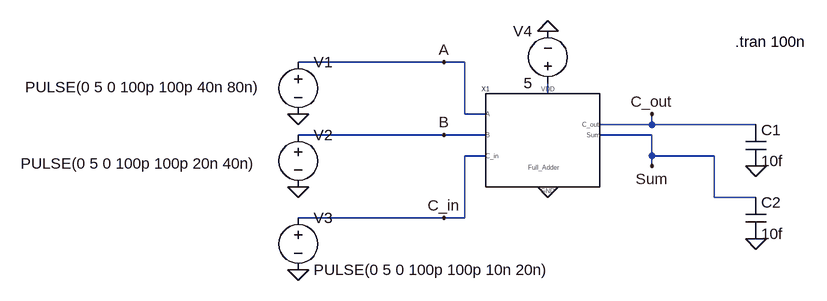
[diagram p0: schematic Full_adder_test.asc]
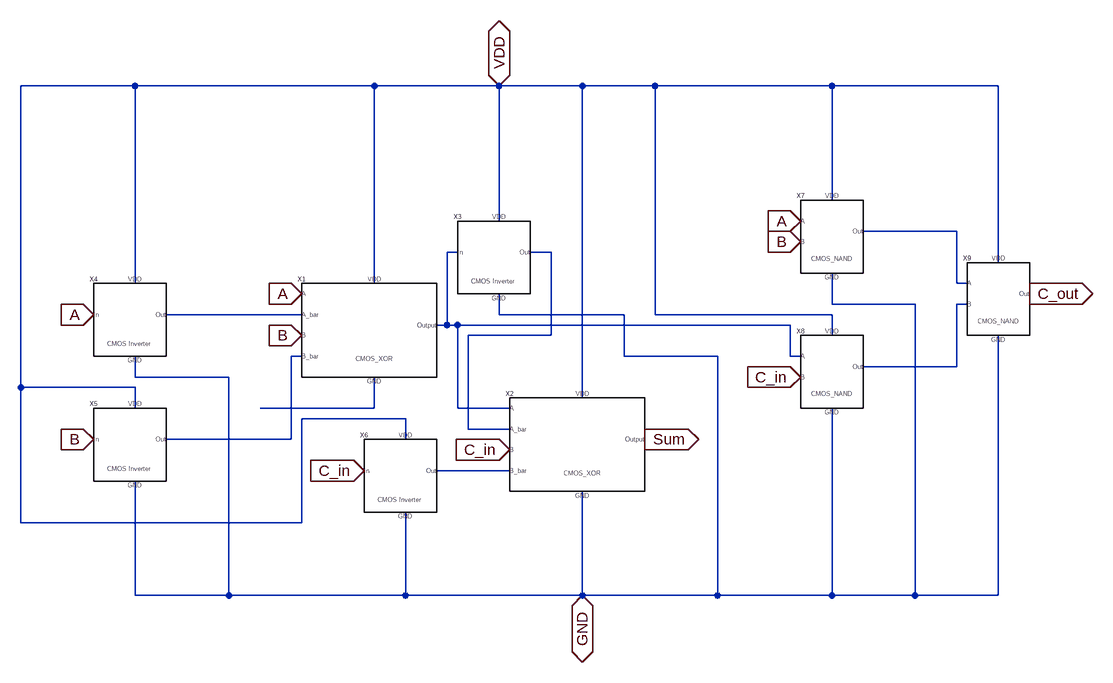
[diagram p1: sub-circuit full_adder.asc]
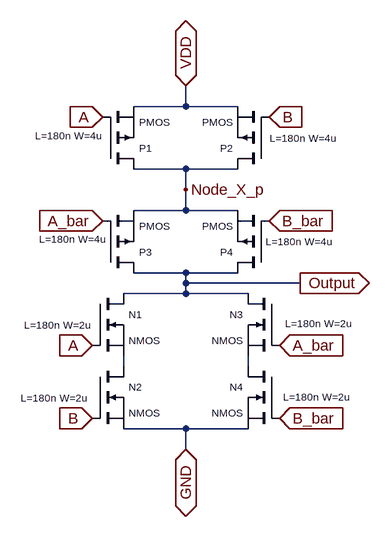
[diagram p2: sub-circuit cmos_xor.asc]
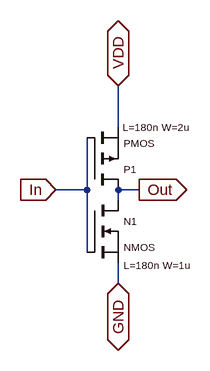
[diagram p3: sub-circuit cmos_inveter.asc]
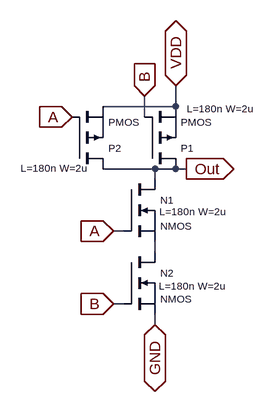
[diagram p4: sub-circuit cmos_nand_2input.asc]
Full_adder_test.asc, the LTspice schematic file:
Version 4.1
SHEET 1 1140 680
WIRE 224 32 0 32
WIRE 256 32 224 32
WIRE 384 80 384 64
WIRE 256 112 256 32
WIRE 288 112 256 112
WIRE 544 128 544 112
WIRE 544 128 464 128
WIRE 704 128 544 128
WIRE 224 144 0 144
WIRE 288 144 224 144
WIRE 544 144 464 144
WIRE 288 176 256 176
WIRE 544 176 544 144
WIRE 640 176 544 176
WIRE 544 192 544 176
WIRE 640 240 640 176
WIRE 704 240 640 240
WIRE 224 272 0 272
WIRE 256 272 256 176
WIRE 256 272 224 272
FLAG 0 112 0
FLAG 0 224 0
FLAG 0 352 0
FLAG 384 -16 0
FLAG 384 224 0
FLAG 544 112 C_out
FLAG 544 192 Sum
FLAG 224 32 A
FLAG 224 144 B
FLAG 224 272 C_in
FLAG 704 192 0
FLAG 704 304 0
SYMBOL Full_adder 368 144 R0
SYMATTR InstName X1
SYMBOL voltage 0 16 R0
WINDOW 3 -420 54 Left 2
WINDOW 123 0 0 Left 0
WINDOW 39 0 0 Left 0
SYMATTR InstName V1
SYMATTR Value PULSE(0 5 0 100p 100p 40n 80n)
SYMBOL voltage 0 128 R0
WINDOW 3 -427 60 Left 2
WINDOW 123 0 0 Left 0
WINDOW 39 0 0 Left 0
SYMATTR InstName V2
SYMATTR Value PULSE(0 5 0 100p 100p 20n 40n)
SYMBOL voltage 0 256 R0
WINDOW 123 0 0 Left 0
WINDOW 39 0 0 Left 0
SYMATTR InstName V3
SYMATTR Value PULSE(0 5 0 100p 100p 10n 20n)
SYMBOL voltage 384 80 R180
WINDOW 0 24 96 Left 2
WINDOW 3 24 16 Left 2
WINDOW 123 0 0 Left 0
WINDOW 39 0 0 Left 0
SYMATTR InstName V4
SYMATTR Value 5
SYMBOL cap 688 128 R0
SYMATTR InstName C1
SYMATTR Value 10f
SYMBOL cap 688 240 R0
SYMATTR InstName C2
SYMATTR Value 10f
TEXT 672 0 Left 2 !.tran 100n

full_adder.asc, the sub-circuit schematic file:
Version 4.1
SHEET 1 1296 680
WIRE -208 -320 -384 -320
WIRE 160 -320 -208 -320
WIRE 352 -320 160 -320
WIRE 480 -320 352 -320
WIRE 592 -320 480 -320
WIRE 864 -320 592 -320
WIRE 1120 -320 864 -320
WIRE 864 -144 864 -320
WIRE 352 -112 352 -320
WIRE 1056 -96 912 -96
WIRE 288 -64 272 -64
WIRE 432 -64 400 -64
WIRE 1120 -48 1120 -320
WIRE -208 -16 -208 -320
WIRE 160 -16 160 -320
WIRE 1056 -16 1056 -96
WIRE 1072 -16 1056 -16
WIRE 864 16 864 -32
WIRE 992 16 864 16
WIRE 1072 16 1056 16
WIRE 48 32 -160 32
WIRE 352 32 352 0
WIRE 544 32 352 32
WIRE 592 32 592 -320
WIRE 864 32 592 32
WIRE 272 48 272 -64
WIRE 272 48 256 48
WIRE 288 48 272 48
WIRE 800 48 288 48
WIRE 432 64 432 -64
WIRE 432 64 304 64
WIRE 864 64 864 32
WIRE 48 96 32 96
WIRE 544 96 544 32
WIRE 688 96 544 96
WIRE 800 96 800 48
WIRE 816 96 800 96
WIRE 1056 112 1056 16
WIRE 1056 112 912 112
WIRE -208 128 -208 96
WIRE -64 128 -208 128
WIRE -384 144 -384 -320
WIRE -208 144 -384 144
WIRE 480 160 480 -320
WIRE -208 176 -208 144
WIRE 160 176 160 128
WIRE 160 176 -16 176
WIRE 288 176 288 48
WIRE 368 176 288 176
WIRE 208 192 48 192
WIRE 304 208 304 64
WIRE 368 208 304 208
WIRE 32 224 32 96
WIRE 32 224 -160 224
WIRE 208 224 208 192
WIRE 368 272 256 272
WIRE -384 352 -384 144
WIRE 48 352 48 192
WIRE 48 352 -384 352
WIRE -208 464 -208 288
WIRE -64 464 -64 128
WIRE -64 464 -208 464
WIRE 208 464 208 336
WIRE 208 464 -64 464
WIRE 480 464 480 304
WIRE 480 464 208 464
WIRE 688 464 688 96
WIRE 688 464 480 464
WIRE 864 464 864 176
WIRE 864 464 688 464
WIRE 992 464 992 16
WIRE 992 464 864 464
WIRE 1120 464 1120 64
WIRE 1120 464 992 464
FLAG 48 0 A
IOPIN 48 0 In
FLAG 48 64 B
IOPIN 48 64 In
FLAG 368 240 C_in
IOPIN 368 240 In
FLAG -272 32 A
IOPIN -272 32 In
FLAG -272 224 B
IOPIN -272 224 In
FLAG 144 272 C_in
IOPIN 144 272 In
FLAG 576 224 Sum
IOPIN 576 224 Out
FLAG 816 -112 A
IOPIN 816 -112 In
FLAG 816 -80 B
IOPIN 816 -80 In
FLAG 816 128 C_in
IOPIN 816 128 In
FLAG 1168 0 C_out
IOPIN 1168 0 Out
FLAG 352 -320 VDD
IOPIN 352 -320 BiDir
FLAG 480 464 GND
IOPIN 480 464 BiDir
SYMBOL CMOS_XOR 144 48 R0
SYMATTR InstName X1
SYMBOL CMOS_XOR 464 224 R0
SYMATTR InstName X2
SYMBOL CMOS_Inveter -224 32 R0
SYMATTR InstName X4
SYMBOL CMOS_Inveter -224 224 R0
SYMATTR InstName X5
SYMBOL CMOS_Inveter 336 -64 R0
SYMATTR InstName X3
SYMBOL CMOS_Inveter 192 272 R0
SYMATTR InstName X6
SYMBOL CMOS_NAND_2input 864 -96 R0
SYMATTR InstName X7
SYMBOL CMOS_NAND_2input 864 112 R0
SYMATTR InstName X8
SYMBOL CMOS_NAND_2input 1120 0 R0
SYMATTR InstName X9

cmos_xor.asc, the sub-circuit schematic file:
Version 4.1
SHEET 1 880 680
WIRE 208 -192 208 -224
WIRE 208 -192 128 -192
WIRE 288 -192 208 -192
WIRE 208 -96 128 -96
WIRE 288 -96 208 -96
WIRE 208 -64 208 -96
WIRE 208 -32 208 -64
WIRE 208 -32 128 -32
WIRE 288 -32 208 -32
WIRE 208 64 128 64
WIRE 288 64 208 64
WIRE 208 80 208 64
WIRE 384 80 208 80
WIRE 208 96 208 80
WIRE 208 96 112 96
WIRE 304 96 208 96
WIRE 112 208 112 192
WIRE 304 208 304 192
WIRE 208 304 112 304
WIRE 304 304 208 304
WIRE 208 336 208 304
FLAG 64 176 A
IOPIN 64 176 In
FLAG 64 288 B
IOPIN 64 288 In
FLAG 352 176 A_bar
IOPIN 352 176 In
FLAG 352 288 B_bar
IOPIN 352 288 In
FLAG 208 336 GND
IOPIN 208 336 BiDir
FLAG 208 -224 VDD
IOPIN 208 -224 BiDir
FLAG 384 80 Output
IOPIN 384 80 Out
FLAG 80 -176 A
IOPIN 80 -176 In
FLAG 80 -16 A_bar
IOPIN 80 -16 In
FLAG 336 -176 B
IOPIN 336 -176 In
FLAG 336 -16 B_bar
IOPIN 336 -16 In
FLAG 208 -64 Node_X_p
SYMBOL nmos 64 208 R0
WINDOW 0 56 32 Left 1
WINDOW 3 56 72 Left 1
WINDOW 123 -110 49 Left 1
SYMATTR InstName N2
SYMATTR Value2 L=180n W=2u
SYMBOL nmos 64 96 R0
WINDOW 0 56 32 Left 1
WINDOW 3 56 72 Left 1
WINDOW 123 -105 48 Left 1
SYMATTR InstName N1
SYMATTR Value2 L=180n W=2u
SYMBOL nmos 352 96 M0
WINDOW 0 56 32 Left 1
WINDOW 3 56 72 Left 1
WINDOW 123 -110 46 Left 1
SYMATTR InstName N3
SYMATTR Value2 L=180n W=2u
SYMBOL nmos 352 208 M0
WINDOW 0 56 32 Left 1
WINDOW 3 56 72 Left 1
WINDOW 123 -107 47 Left 1
SYMATTR InstName N4
SYMATTR Value2 L=180n W=2u
SYMBOL pmos 80 64 M180
WINDOW 0 56 32 Left 1
WINDOW 3 56 72 Left 1
WINDOW 123 251 48 Left 1
SYMATTR InstName P3
SYMATTR Value2 L=180n W=4u
SYMBOL pmos 336 64 R180
WINDOW 0 56 32 Left 1
WINDOW 3 56 72 Left 1
WINDOW 123 252 52 Left 1
SYMATTR InstName P4
SYMATTR Value2 L=180n W=4u
SYMBOL pmos 336 -96 R180
WINDOW 0 56 32 Left 1
WINDOW 3 56 72 Left 1
WINDOW 123 258 51 Left 1
SYMATTR InstName P2
SYMATTR Value2 L=180n W=4u
SYMBOL pmos 80 -96 M180
WINDOW 0 56 32 Left 1
WINDOW 3 56 72 Left 1
WINDOW 123 257 47 Left 1
SYMATTR InstName P1
SYMATTR Value2 L=180n W=4u

cmos_inveter.asc, the sub-circuit schematic file:
Version 4.1
SHEET 1 880 680
WIRE -112 -32 -112 -96
WIRE -160 64 -160 -16
WIRE -160 64 -208 64
WIRE -80 64 -112 64
WIRE -112 80 -112 64
WIRE -160 160 -160 64
WIRE -112 208 -112 176
FLAG -80 64 Out
IOPIN -80 64 Out
FLAG -208 64 In
IOPIN -208 64 In
FLAG -112 -96 VDD
IOPIN -112 -96 BiDir
FLAG -112 208 GND
IOPIN -112 208 BiDir
SYMBOL nmos -160 80 R0
WINDOW 0 56 32 Left 1
WINDOW 3 56 72 Left 1
WINDOW 123 56 100 Left 1
SYMATTR InstName N1
SYMATTR Value2 L=180n W=1u
SYMBOL pmos -160 64 M180
WINDOW 0 56 32 Left 1
WINDOW 3 56 72 Left 1
WINDOW 123 55 96 Left 1
SYMATTR InstName P1
SYMATTR Value2 L=180n W=2u

cmos_nand_2input.asc, the sub-circuit schematic file:
Version 4.1
SHEET 1 880 680
WIRE 144 -192 144 -224
WIRE 144 -192 32 -192
WIRE 96 -176 96 -208
WIRE 112 -96 32 -96
WIRE 144 -96 112 -96
WIRE 160 -96 144 -96
WIRE 112 -80 112 -96
WIRE 64 0 48 0
WIRE 112 32 112 16
WIRE 64 112 48 112
WIRE 112 144 112 128
FLAG -16 -176 A
IOPIN -16 -176 In
FLAG 96 -208 B
IOPIN 96 -208 In
FLAG 144 -224 VDD
IOPIN 144 -224 BiDir
FLAG 112 144 GND
IOPIN 112 144 BiDir
FLAG 48 0 A
IOPIN 48 0 In
FLAG 48 112 B
IOPIN 48 112 In
FLAG 160 -96 Out
IOPIN 160 -96 Out
SYMBOL pmos 96 -96 M180
WINDOW 0 56 32 Left 1
WINDOW 3 56 72 Left 1
WINDOW 123 65 93 Left 1
SYMATTR InstName P1
SYMATTR Value2 L=180n W=2u
SYMBOL pmos -16 -96 M180
WINDOW 0 56 32 Left 1
WINDOW 3 56 72 Left 1
WINDOW 123 -79 1 Left 1
SYMATTR InstName P2
SYMATTR Value2 L=180n W=2u
SYMBOL nmos 64 -80 R0
WINDOW 0 56 32 Left 1
WINDOW 3 56 72 Left 1
WINDOW 123 55 50 Left 1
SYMATTR InstName N1
SYMATTR Value2 L=180n W=2u
SYMBOL nmos 64 32 R0
WINDOW 0 56 32 Left 1
WINDOW 3 56 72 Left 1
WINDOW 123 54 52 Left 1
SYMATTR InstName N2
SYMATTR Value2 L=180n W=2u

The netlist it stands for:
* Full_adder_test.asc
X§X1 A B C_in C_out 0 Sum N001 full_adder
V1 A 0 PULSE(0 5 0 100p 100p 40n 80n)
V2 B 0 PULSE(0 5 0 100p 100p 20n 40n)
V3 C_in 0 PULSE(0 5 0 100p 100p 10n 20n)
V4 N001 0 5
C1 C_out 0 10f
C2 Sum 0 10f

* block symbol definitions
.subckt full_adder A B C_in C_out GND Sum VDD
X§X1 A N005 B N006 N007 N002 VDD cmos_xor
X§X2 N002 N003 C_in N008 GND Sum VDD cmos_xor
X§X4 A GND N005 VDD cmos_inveter
X§X5 B GND N006 VDD cmos_inveter
X§X3 N002 GND N003 VDD cmos_inveter
X§X6 C_in GND N008 VDD cmos_inveter
X§X7 A B GND N001 VDD cmos_nand_2input
X§X8 N002 C_in GND N004 VDD cmos_nand_2input
X§X9 N001 N004 GND C_out VDD cmos_nand_2input
.ends full_adder

.subckt cmos_xor A A_bar B B_bar GND Output VDD
M§N2 N001 B GND GND NMOS L=180n W=2u
M§N1 Output A N001 N001 NMOS L=180n W=2u
M§N3 Output A_bar N002 N002 NMOS L=180n W=2u
M§N4 N002 B_bar GND GND NMOS L=180n W=2u
M§P3 Output A_bar Node_X_p Node_X_p PMOS L=180n W=4u
M§P4 Output B_bar Node_X_p Node_X_p PMOS L=180n W=4u
M§P2 Node_X_p B VDD VDD PMOS L=180n W=4u
M§P1 Node_X_p A VDD VDD PMOS L=180n W=4u
.ends cmos_xor

.subckt cmos_inveter In GND Out VDD
M§N1 Out In GND GND NMOS L=180n W=1u
M§P1 Out In VDD VDD PMOS L=180n W=2u
.ends cmos_inveter

.subckt cmos_nand_2input A B GND Out VDD
M§P1 Out B VDD VDD PMOS L=180n W=2u
M§P2 Out A VDD VDD PMOS L=180n W=2u
M§N1 Out A N001 N001 NMOS L=180n W=2u
M§N2 N001 B GND GND NMOS L=180n W=2u
.ends cmos_nand_2input

.model NMOS NMOS
.model PMOS PMOS
.lib standard.mos
.tran 100n
.backanno
.end

* Results of the author's LTspice run, read from the files saved beside the schematic
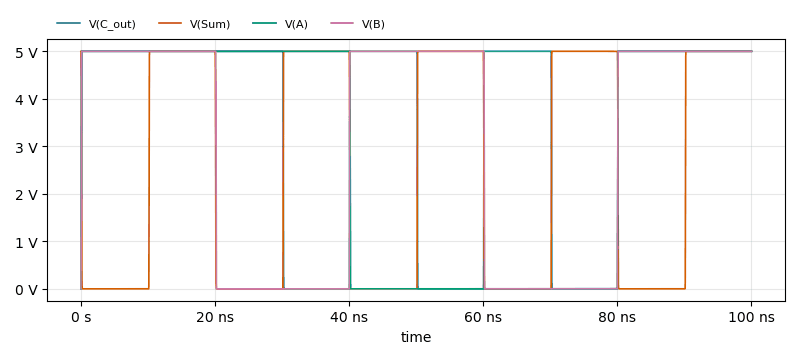
[diagram p5: Transient Analysis of Full_adder_test.asc, plotted from the saved traces]
* Transient Analysis, 1 run:
*   V(C_out): min -89.75 µV, max 5 V, average 3.513 V, rms 4.189 V, last 5 V
*   V(Sum): min -1.948 µV, max 5.001 V, average 2.481 V, rms 3.518 V, last 5 V
*   V(A): min 0 V, max 5 V, average 3.002 V, rms 3.873 V, last 5 V
*   V(B): min 0 V, max 5 V, average 3.007 V, rms 3.875 V, last 5 V